# Altium project HDMI-MIPI-Bridge.PrjPcb
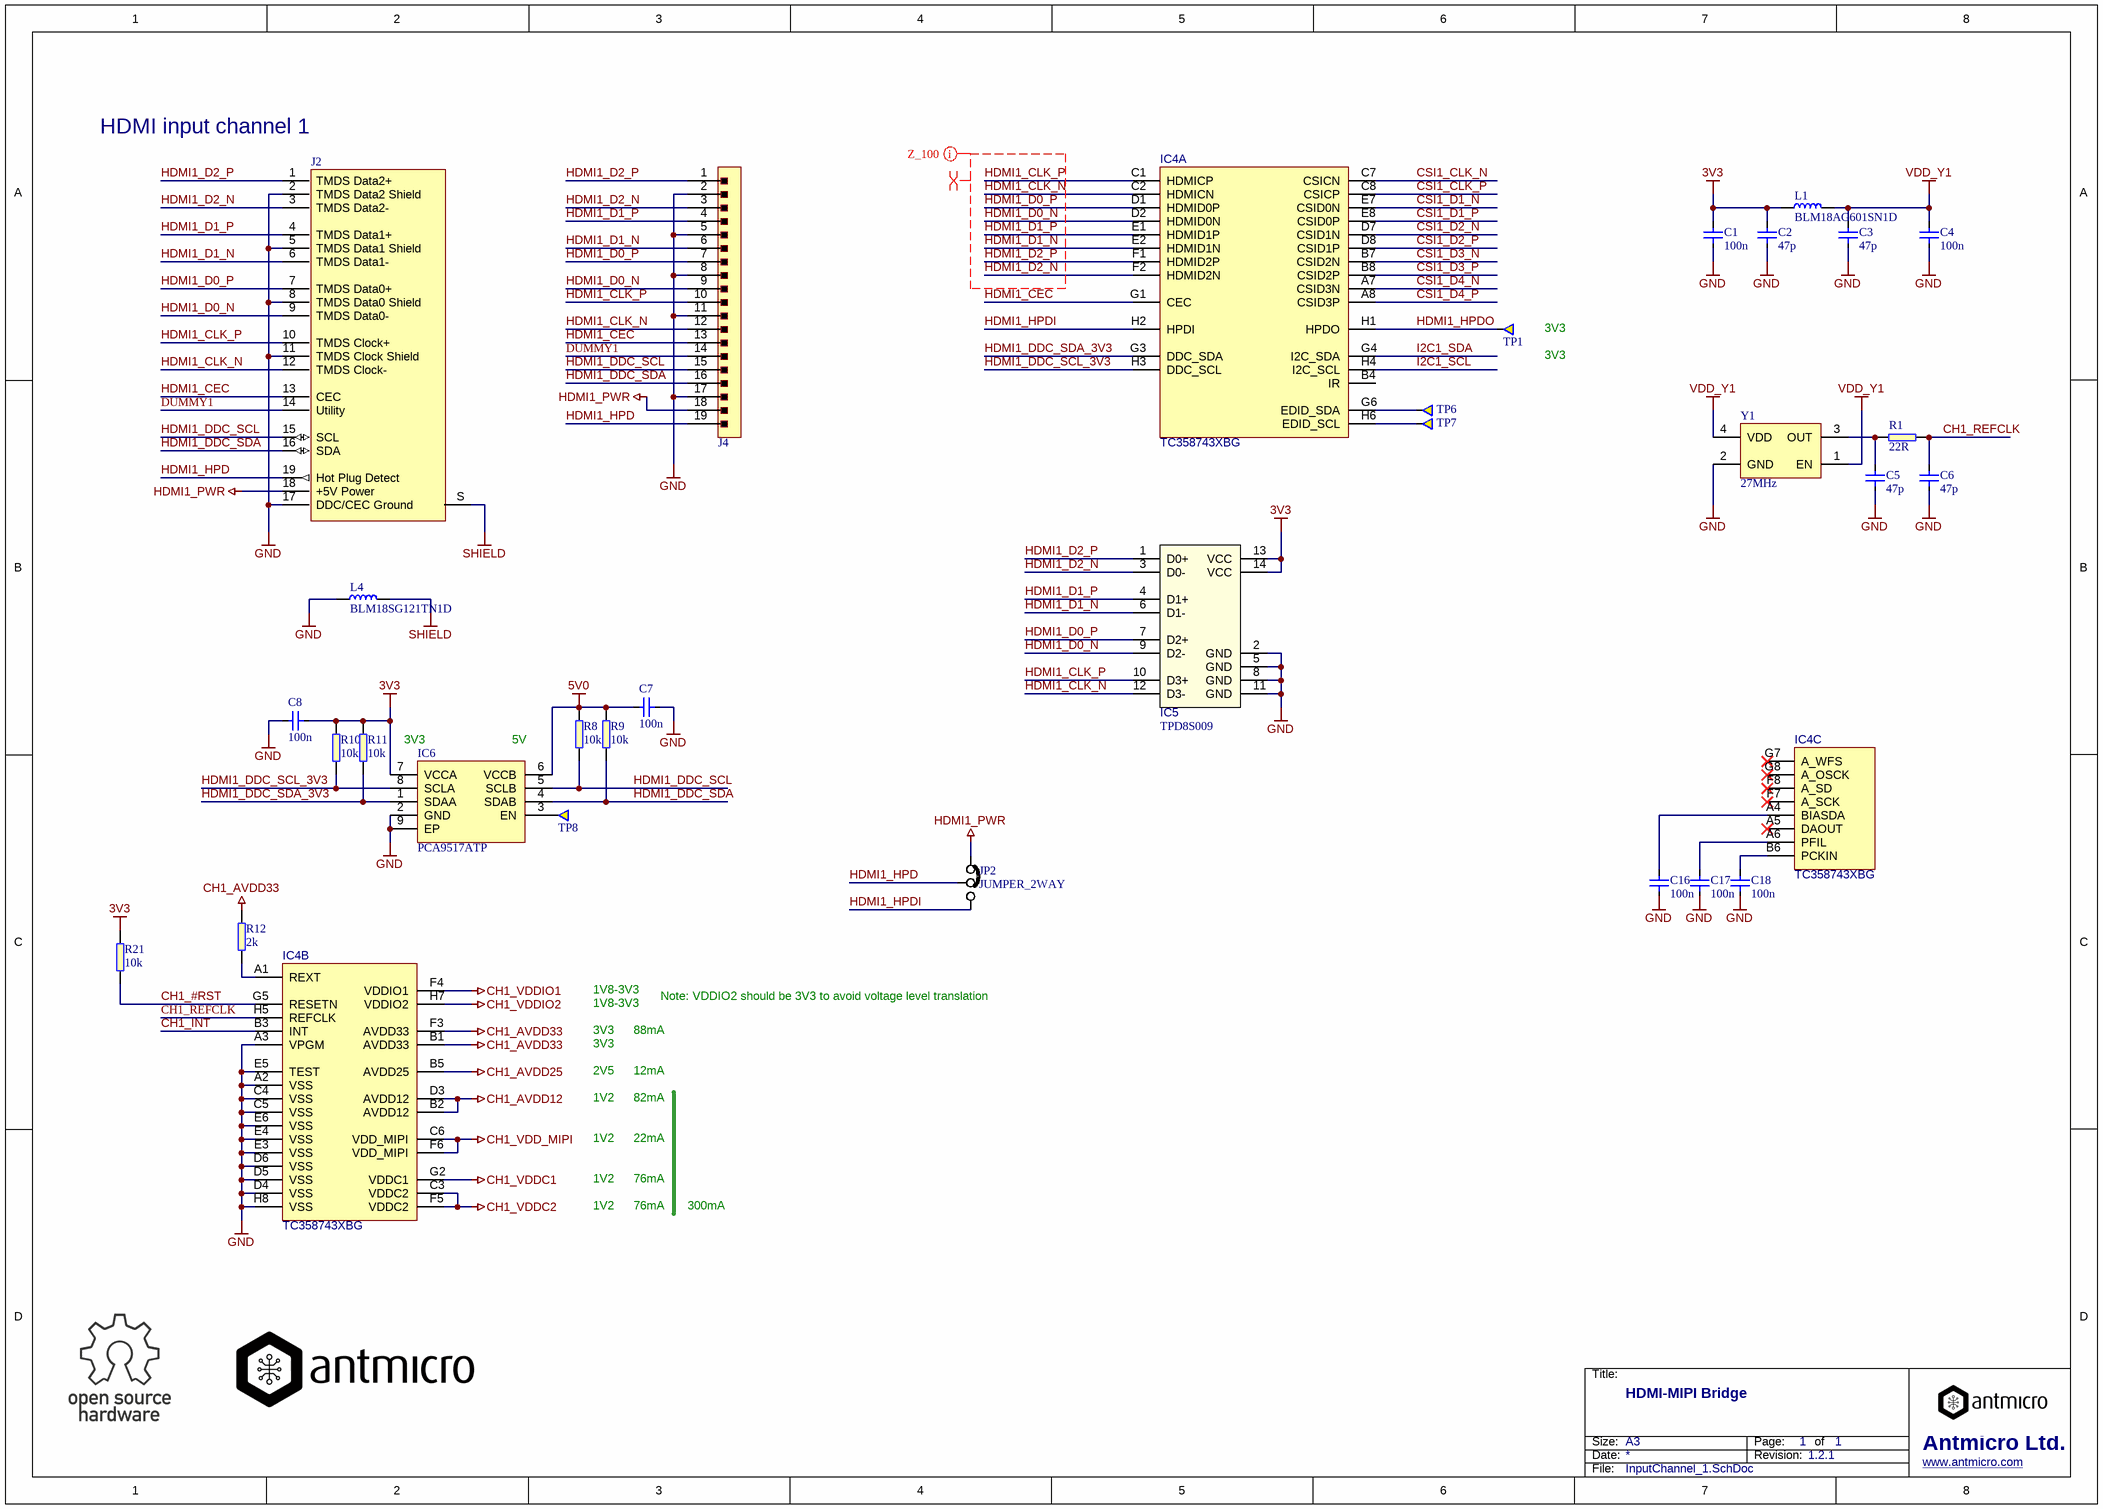
[diagram p0: InputChannel_1.SchDoc]
AM_Title: HDMI-MIPI Bridge; AM_Status: OSHW; AM_Revision: 1.2.1; AM_Author: P.Katarzynski
3 sheets, 113 parts. Net scope: global (net labels, ports and power ports of the same name join across sheets).
Board file: PCB.PcbDoc
Sheets:
  InputChannel_1.SchDoc
  InputChannel_2.SchDoc
  InterfaceConnector.SchDoc

## Sheet InputChannel_1.SchDoc
size A3; SheetNumber: 1; SheetTotal: 1; PageSetup: Record=PageOptions|CenterHorizontal=True|CenterVertical=True|PrintScale=0.97|XCorrection=1.00|YCorrection=1.00|PrintKind=1|BorderSize=5000000|LeftOffset=0|BottomOffset=0|Orientation=2|PaperLength=2970|PaperWidth=2100|Scale=100|PaperSource=7|PrintQuality=600|MediaType=1|DitherType=10|PaperKind=A4|PrintScaleMode=1

### Parts
C1  100n  [0402]
C2  47p  [0402]
C3  47p  [0402]
C4  100n  [0402]
C5  47p  [0402]
C6  47p  [0402]
C7  100n  [0402]
C8  100n  [0402]
C16  100n  [0402]
C17  100n  [0402]
C18  100n  [0402]
IC4  TC358743XBG  [TC358743XBG]  (parts A,B,C of 3)
IC5  TPD8S009  [SON-15]
IC6  PCA9517ATP  [PCA9517ATP]
J2  (no value)  [Molex_HDMI_471511001]
J4  Molex-505110-1992  [CON-Molex-505110-1992]  (value not drawn)
JP2  JUMPER_2WAY  [JUMPER_2WAY]  (no BOM)
L1  BLM18AG601SN1D  [0603]
L4  BLM18SG121TN1D  [0603]
R1  22R  [0402]
R8  10k  [0402]
R9  10k  [0402]
R10  10k  [0402]
R11  10k  [0402]
R12  2k  [0603]
R21  10k  [0402]
TP1  Testpad  [TP-R-1]  (value not drawn)  (no BOM)
TP6  Testpad  [TP-R-1]  (value not drawn)  (no BOM)
TP7  Testpad  [TP-R-1]  (value not drawn)  (no BOM)
TP8  Testpad  [TP-R-1]  (value not drawn)  (no BOM)
Y1  27MHz  [TXC_7C]

### Nets
3V3: C1.2 C2.2 C8.1 IC5.13(VCC) IC5.14(VCC) IC6.7(VCCA) L1.1 R10.2 R11.2 R21.2
5V0: C7.2 IC6.6(VCCB) R8.2 R9.2
CH1_AVDD12: IC4.B2(AVDD12) IC4.D3(AVDD12)
CH1_AVDD25: IC4.B5(AVDD25)
CH1_AVDD33: IC4.B1(AVDD33) IC4.F3(AVDD33) R12.2
CH1_VDD_MIPI: IC4.C6(VDD_MIPI) IC4.F6(VDD_MIPI)
CH1_VDDC1: IC4.G2(VDDC1)
CH1_VDDC2: IC4.C3(VDDC2) IC4.F5(VDDC2)
CH1_VDDIO1: IC4.F4(VDDIO1)
CH1_VDDIO2: IC4.H7(VDDIO2)
GND: C1.1 C2.1 C3.1 C4.1 C5.1 C6.1 C7.1 C8.2 C16.1 C17.1 C18.1 IC4.A2(VSS) IC4.A3(VPGM) IC4.C4(VSS) IC4.C5(VSS) IC4.D4(VSS) IC4.D5(VSS) IC4.D6(VSS) IC4.E3(VSS) IC4.E4(VSS) IC4.E5(TEST) IC4.E6(VSS) IC4.H8(VSS) IC5.2(GND) IC5.5(GND) IC5.8(GND) IC5.11(GND) IC6.2(GND) IC6.9(EP) J2.2(TMDS_Data2_Shield) J2.5(TMDS_Data1_Shield) J2.8(TMDS_Data0_Shield) J2.11(TMDS_Clock_Shield) J2.17(DDC/CEC_Ground) J4.2 J4.5 J4.8 J4.11 J4.17 L4.1 Y1.2(GND)
HDMI1_PWR: J2.18(+5V_Power) J4.18 JP2.1
SHIELD: J2.S(SH) L4.2
VDD_Y1: C3.2 C4.2 L1.2 Y1.1(EN) Y1.4(VDD)
CH1_#RST: IC4.G5(RESETN) R21.1
CH1_INT: IC4.B3(INT)
CH1_REFCLK: C6.2 IC4.H5(REFCLK) R1.2
CSI1_CLK_N: IC4.C7(CSICN)
CSI1_CLK_P: IC4.C8(CSICP)
CSI1_D1_N: IC4.E7(CSID0N)
CSI1_D1_P: IC4.E8(CSID0P)
CSI1_D2_N: IC4.D7(CSID1N)
CSI1_D2_P: IC4.D8(CSID1P)
CSI1_D3_N: IC4.B7(CSID2N)
CSI1_D3_P: IC4.B8(CSID2P)
CSI1_D4_N: IC4.A7(CSID3N)
CSI1_D4_P: IC4.A8(CSID3P)
DUMMY1: J2.14(Utility) J4.14
HDMI1_CEC: IC4.G1(CEC) J2.13(CEC) J4.13
HDMI1_CLK_N: IC4.C2(HDMICN) IC5.12(D3-) J2.12(TMDS_Clock-) J4.12
HDMI1_CLK_P: IC4.C1(HDMICP) IC5.10(D3+) J2.10(TMDS_Clock+) J4.10
HDMI1_D0_N: IC4.D2(HDMID0N) IC5.9(D2-) J2.9(TMDS_Data0-) J4.9
HDMI1_D0_P: IC4.D1(HDMID0P) IC5.7(D2+) J2.7(TMDS_Data0+) J4.7
HDMI1_D1_N: IC4.E2(HDMID1N) IC5.6(D1-) J2.6(TMDS_Data1-) J4.6
HDMI1_D1_P: IC4.E1(HDMID1P) IC5.4(D1+) J2.4(TMDS_Data1+) J4.4
HDMI1_D2_N: IC4.F2(HDMID2N) IC5.3(D0-) J2.3(TMDS_Data2-) J4.3
HDMI1_D2_P: IC4.F1(HDMID2P) IC5.1(D0+) J2.1(TMDS_Data2+) J4.1
HDMI1_DDC_SCL: IC6.5(SCLB) J2.15(SCL) J4.15 R8.1
HDMI1_DDC_SCL_3V3: IC4.H3(DDC_SCL) IC6.8(SCLA) R10.1
HDMI1_DDC_SDA: IC6.4(SDAB) J2.16(SDA) J4.16 R9.1
HDMI1_DDC_SDA_3V3: IC4.G3(DDC_SDA) IC6.1(SDAA) R11.1
HDMI1_HPD: J2.19(Hot_Plug_Detect) J4.19 JP2.2
HDMI1_HPDI: IC4.H2(HPDI) JP2.3
HDMI1_HPDO: IC4.H1(HPDO) TP1.1
I2C1_SCL: IC4.H4(I2C_SCL)
I2C1_SDA: IC4.G4(I2C_SDA)
NetC5_2: C5.2 R1.1 Y1.3(OUT)
NetC16_2: C16.2 IC4.A4(BIASDA)
NetC17_2: C17.2 IC4.A6(PFIL)
NetC18_2: C18.2 IC4.B6(PCKIN)
NetIC4_A1: IC4.A1(REXT) R12.1
NetIC4_G6: IC4.G6(EDID_SDA) TP6.1
NetIC4_H6: IC4.H6(EDID_SCL) TP7.1
NetIC6_3: IC6.3(EN) TP8.1

Not connected (* = marked no-connect by the designer): IC4 A5(DAOUT)* B4(IR) F7(A_SCK)* F8(A_SD)* G7(A_WFS)* G8(A_OSCK)*

### Layout directives
net class Z_100: HDMI1_CLK_N, HDMI1_CLK_P, HDMI1_D0_N, HDMI1_D0_P, HDMI1_D1_N, HDMI1_D1_P, HDMI1_D2_N, HDMI1_D2_P
differential pair: HDMI1_CLK_N, HDMI1_CLK_P, HDMI1_D0_N, HDMI1_D0_P, HDMI1_D1_N, HDMI1_D1_P, HDMI1_D2_N, HDMI1_D2_P

### Notes on the sheet
- (near J2) HDMI input channel 1
- (near TP1) 3V3
- 3V3
- (near IC6) 5V
- 1V8-3V3
- 88mA
- Note: VDDIO2 should be 3V3 to avoid voltage level translation
- 2V5
- 1V2
- 82mA
- 12mA
- 76mA
- 22mA
- 300mA
- Title:
- Size:
- Date:
- A3
- Revision:
- Page:
- of
- Antmicro Ltd.
- File:
- www.antmicro.com

### Library data of the parts
C1 C4 C7 C8 C16-C18 = C_100n_0402: MLCC SMT Capacitor 100nF 0402; Manufacturer: MULTICOMP; MPN: MC0402X104M100CT; Part Number: C_100n_0402; Value: 100n; Supplier 1: Farnell; Supplier Part Number 1: 2309011
C2 C3 C5 C6 = C_47p_0402: MLCC SMT Capacitor 47pF 0402; Manufacturer: KEMET; MPN: C0402C470J5GACTU; Part Number: C_47p_0402; Value: 47p; Supplier 1: Farnell; Supplier Part Number 1: 1414592
IC4 = TC358743XBG: Toshiba TC358743XBG HDMI-CSI bridge; Part Number: TC358743XBG; Value: TC358743XBG; Manufacturer: Toshiba; MPN: TC358743XBG
IC5 = TPD8S009: 8-Channel ESD Protection for DisplayPort and HDMI; Manufacturer: TEXAS INSTRUMENTS; MPN: TPD8S009DSMR; Part Number: TPD8S009; Value: TPD8S009; Supplier 1: Farnell; Supplier Part Number 1: 1772003
IC6 = PCA9517ATP: I2C BUS REPEATER W/ LEVEL TRANS, HWSON-8; Manufacturer: NXP; Part Number: PCA9517ATP; Value: PCA9517ATP; Supplier 1: Digi-Key; Supplier Part Number 1: 568-9816-1-ND; MPN: PCA9517ATP
J2 = CON-Molex-471511001: Header right angle HDMI; Manufacturer: MOLEX; MPN: 47151-1001; Part Number: CON-Molex-471511001; Supplier 1: Farnell; Supplier Part Number 1: 1516661
J4 = CON-Molex-505110-1992: FPC socket 19 pins; Manufacturer: Molex; Part Number: CON-Molex-505110-1992; Supplier Part Number 1: WM12375CT-ND; Value: Molex-505110-1992; Supplier 1: Digi-Key; MPN: 505110-1992
JP2 = Jumper 2 way: Solder jumper; Part Number: Jumper 2 way
L1 = BLM18AG601SN1D: Ferrite Bead, 600 ohm, 0603 [1608 Metric], BLM18A Series, 500 mA, 0.38 ohm, ± 25%; Manufacturer: MURATA; Part Number: BLM18AG601SN1D; Value: BLM18AG601SN1D; Supplier 1: Farnell; Supplier Part Number 1: 1515679; MPN: BLM18AG601SN1D
L4 = BLM18SG121TN1D: FERRITE BEAD, 0.025OHM, 3A, 0603; Manufacturer: MURATA; Part Number: BLM18SG121TN1D; Value: BLM18SG121TN1D; Supplier 1: Farnell; Supplier Part Number 1: 1515752; MPN: BLM18SG121TN1D
R1 = R_22R_0402: SMT Resistor 22R 0402; Manufacturer: VISHAY; MPN: CRCW040222R0FKED; Part Number: R_22R_0402; Value: 22R; Supplier 1: Farnell; Supplier Part Number 1: 1469697
R8-R11 R21 = R_10k_0402: SMT Resistor 0402; Manufacturer: MULTICOMP; MPN: MCMR04X1002FTL; Part Number: R_10k_0402; Value: 10k; Supplier 1: Farnell; Supplier Part Number 1: 2072517
R12 = R_2k_0603: SMT Resistor 2k 0603; Manufacturer: MULTICOMP; MPN: MCMR06X2001FTL; Part Number: R_2k_0603; Value: 2k; Supplier 1: Farnell; Supplier Part Number 1: 2073418
TP1 TP6-TP8 = TP-R-1: Testpad, round, 1mm; Part Number: TP-R-1
Y1 = 7C-27.000MBB-T: OSC, 27.000MHZ, 3.3V, SMD, 5.0X3.2; Manufacturer: TXC; Part Number: 7C-27.000MBB-T; Value: 27MHz; Supplier 1: Farnell; Supplier Part Number 1: 1842035; MPN: 7C-27.000MBB-T

## Sheet InputChannel_2.SchDoc
size A3; SheetNumber: 1; SheetTotal: 1; PageSetup: Record=PageOptions|CenterHorizontal=True|CenterVertical=True|PrintScale=0.97|XCorrection=1.00|YCorrection=1.00|PrintKind=1|BorderSize=5000000|LeftOffset=0|BottomOffset=0|Orientation=2|PaperLength=2970|PaperWidth=2100|Scale=100|PaperSource=7|PrintQuality=600|MediaType=1|DitherType=10|PaperKind=A4|PrintScaleMode=1
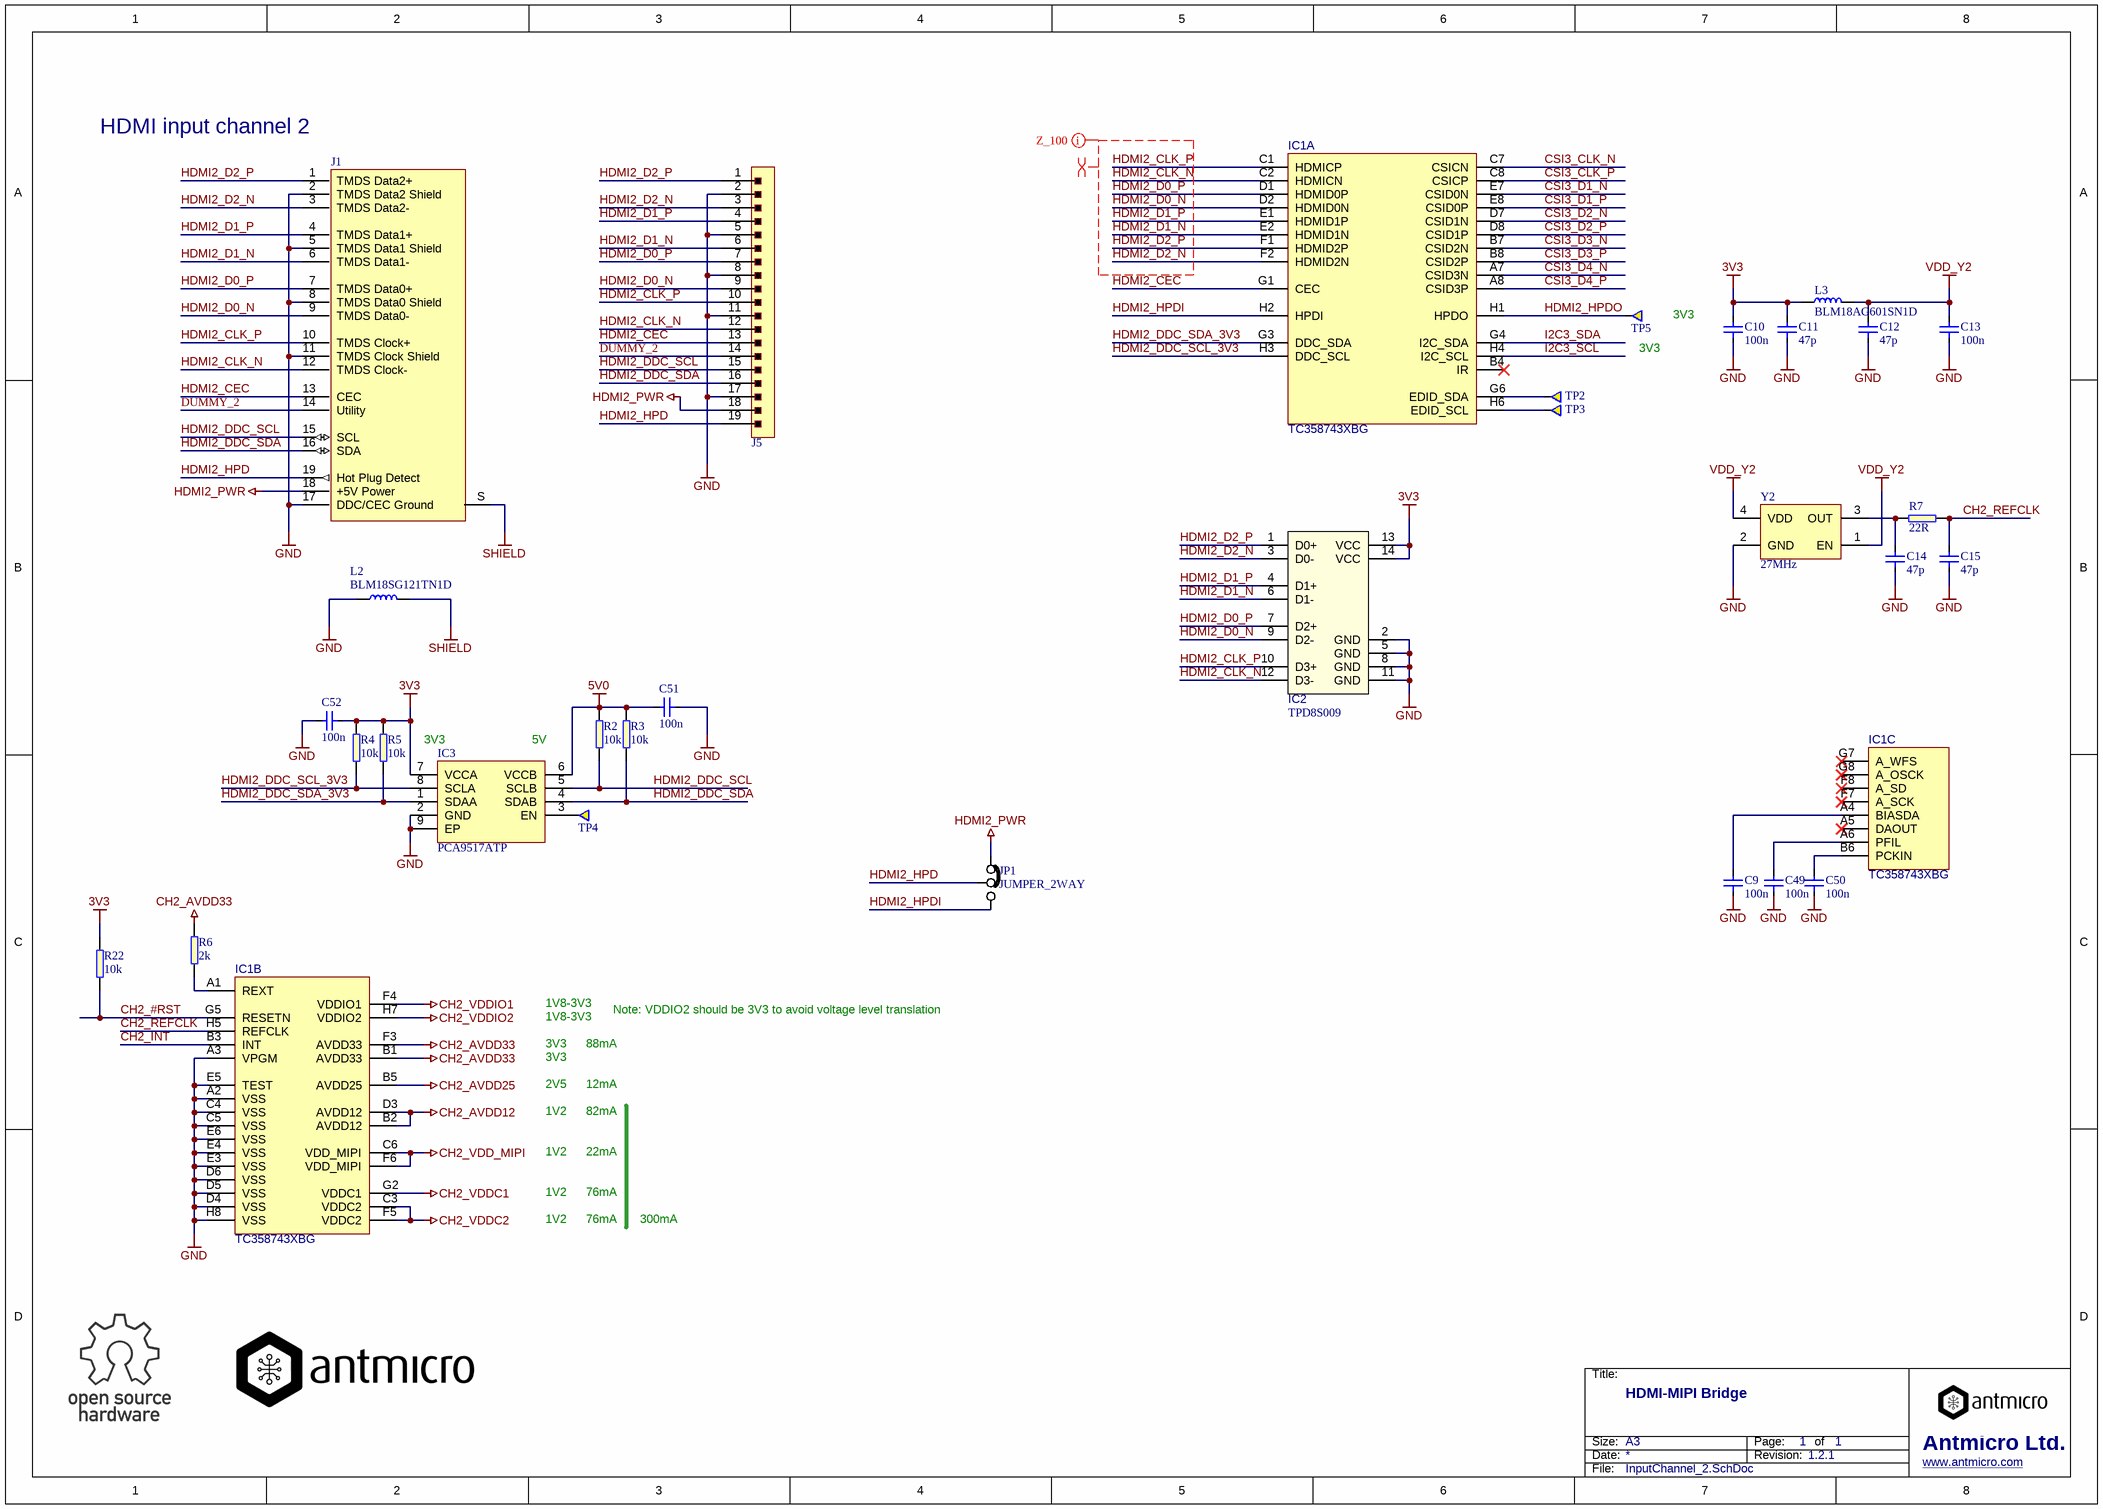
[diagram p1: InputChannel_2.SchDoc]

### Parts
C9  100n  [0402]
C10  100n  [0402]
C11  47p  [0402]
C12  47p  [0402]
C13  100n  [0402]
C14  47p  [0402]
C15  47p  [0402]
C49  100n  [0402]
C50  100n  [0402]
C51  100n  [0402]
C52  100n  [0402]
IC1  TC358743XBG  [TC358743XBG]  (parts A,B,C of 3)
IC2  TPD8S009  [SON-15]
IC3  PCA9517ATP  [PCA9517ATP]
J1  (no value)  [Molex_HDMI_471511001]
J5  Molex-505110-1992  [CON-Molex-505110-1992]  (value not drawn)
JP1  JUMPER_2WAY  [JUMPER_2WAY]  (no BOM)
L2  BLM18SG121TN1D  [0603]
L3  BLM18AG601SN1D  [0603]
R2  10k  [0402]
R3  10k  [0402]
R4  10k  [0402]
R5  10k  [0402]
R6  2k  [0603]
R7  22R  [0402]
R22  10k  [0402]
TP2  Testpad  [TP-R-1]  (value not drawn)  (no BOM)
TP3  Testpad  [TP-R-1]  (value not drawn)  (no BOM)
TP4  Testpad  [TP-R-1]  (value not drawn)  (no BOM)
TP5  Testpad  [TP-R-1]  (value not drawn)  (no BOM)
Y2  27MHz  [TXC_7C]

### Nets
3V3: C10.2 C11.2 C52.1 IC2.13(VCC) IC2.14(VCC) IC3.7(VCCA) L3.1 R4.2 R5.2 R22.2
5V0: C51.2 IC3.6(VCCB) R2.2 R3.2
CH2_AVDD12: IC1.B2(AVDD12) IC1.D3(AVDD12)
CH2_AVDD25: IC1.B5(AVDD25)
CH2_AVDD33: IC1.B1(AVDD33) IC1.F3(AVDD33) R6.2
CH2_VDD_MIPI: IC1.C6(VDD_MIPI) IC1.F6(VDD_MIPI)
CH2_VDDC1: IC1.G2(VDDC1)
CH2_VDDC2: IC1.C3(VDDC2) IC1.F5(VDDC2)
CH2_VDDIO1: IC1.F4(VDDIO1)
CH2_VDDIO2: IC1.H7(VDDIO2)
GND: C9.1 C10.1 C11.1 C12.1 C13.1 C14.1 C15.1 C49.1 C50.1 C51.1 C52.2 IC1.A2(VSS) IC1.A3(VPGM) IC1.C4(VSS) IC1.C5(VSS) IC1.D4(VSS) IC1.D5(VSS) IC1.D6(VSS) IC1.E3(VSS) IC1.E4(VSS) IC1.E5(TEST) IC1.E6(VSS) IC1.H8(VSS) IC2.2(GND) IC2.5(GND) IC2.8(GND) IC2.11(GND) IC3.2(GND) IC3.9(EP) J1.2(TMDS_Data2_Shield) J1.5(TMDS_Data1_Shield) J1.8(TMDS_Data0_Shield) J1.11(TMDS_Clock_Shield) J1.17(DDC/CEC_Ground) J5.2 J5.5 J5.8 J5.11 J5.17 L2.1 Y2.2(GND)
HDMI2_PWR: J1.18(+5V_Power) J5.18 JP1.1
SHIELD: J1.S(SH) L2.2
VDD_Y2: C12.2 C13.2 L3.2 Y2.1(EN) Y2.4(VDD)
CH2_#RST: IC1.G5(RESETN) R22.1
CH2_INT: IC1.B3(INT)
CH2_REFCLK: C15.2 IC1.H5(REFCLK) R7.2
CSI3_CLK_N: IC1.C7(CSICN)
CSI3_CLK_P: IC1.C8(CSICP)
CSI3_D1_N: IC1.E7(CSID0N)
CSI3_D1_P: IC1.E8(CSID0P)
CSI3_D2_N: IC1.D7(CSID1N)
CSI3_D2_P: IC1.D8(CSID1P)
CSI3_D3_N: IC1.B7(CSID2N)
CSI3_D3_P: IC1.B8(CSID2P)
CSI3_D4_N: IC1.A7(CSID3N)
CSI3_D4_P: IC1.A8(CSID3P)
DUMMY_2: J1.14(Utility) J5.14
HDMI2_CEC: IC1.G1(CEC) J1.13(CEC) J5.13
HDMI2_CLK_N: IC1.C2(HDMICN) IC2.12(D3-) J1.12(TMDS_Clock-) J5.12
HDMI2_CLK_P: IC1.C1(HDMICP) IC2.10(D3+) J1.10(TMDS_Clock+) J5.10
HDMI2_D0_N: IC1.D2(HDMID0N) IC2.9(D2-) J1.9(TMDS_Data0-) J5.9
HDMI2_D0_P: IC1.D1(HDMID0P) IC2.7(D2+) J1.7(TMDS_Data0+) J5.7
HDMI2_D1_N: IC1.E2(HDMID1N) IC2.6(D1-) J1.6(TMDS_Data1-) J5.6
HDMI2_D1_P: IC1.E1(HDMID1P) IC2.4(D1+) J1.4(TMDS_Data1+) J5.4
HDMI2_D2_N: IC1.F2(HDMID2N) IC2.3(D0-) J1.3(TMDS_Data2-) J5.3
HDMI2_D2_P: IC1.F1(HDMID2P) IC2.1(D0+) J1.1(TMDS_Data2+) J5.1
HDMI2_DDC_SCL: IC3.5(SCLB) J1.15(SCL) J5.15 R2.1
HDMI2_DDC_SCL_3V3: IC1.H3(DDC_SCL) IC3.8(SCLA) R4.1
HDMI2_DDC_SDA: IC3.4(SDAB) J1.16(SDA) J5.16 R3.1
HDMI2_DDC_SDA_3V3: IC1.G3(DDC_SDA) IC3.1(SDAA) R5.1
HDMI2_HPD: J1.19(Hot_Plug_Detect) J5.19 JP1.2
HDMI2_HPDI: IC1.H2(HPDI) JP1.3
HDMI2_HPDO: IC1.H1(HPDO) TP5.1
I2C3_SCL: IC1.H4(I2C_SCL)
I2C3_SDA: IC1.G4(I2C_SDA)
NetC9_2: C9.2 IC1.A4(BIASDA)
NetC14_2: C14.2 R7.1 Y2.3(OUT)
NetC49_2: C49.2 IC1.A6(PFIL)
NetC50_2: C50.2 IC1.B6(PCKIN)
NetIC1_A1: IC1.A1(REXT) R6.1
NetIC1_G6: IC1.G6(EDID_SDA) TP2.1
NetIC1_H6: IC1.H6(EDID_SCL) TP3.1
NetIC3_3: IC3.3(EN) TP4.1

Not connected (* = marked no-connect by the designer): IC1 A5(DAOUT)* B4(IR)* F7(A_SCK)* F8(A_SD)* G7(A_WFS)* G8(A_OSCK)*

### Layout directives
net class Z_100: HDMI2_CLK_N, HDMI2_CLK_P, HDMI2_D0_N, HDMI2_D0_P, HDMI2_D1_N, HDMI2_D1_P, HDMI2_D2_N, HDMI2_D2_P
differential pair: HDMI2_CLK_N, HDMI2_CLK_P, HDMI2_D0_N, HDMI2_D0_P, HDMI2_D1_N, HDMI2_D1_P, HDMI2_D2_N, HDMI2_D2_P

### Notes on the sheet
- (near J1) HDMI input channel 2
- 3V3
- (near TP5) 3V3
- (near IC3) 5V
- 1V8-3V3
- 88mA
- Note: VDDIO2 should be 3V3 to avoid voltage level translation
- 2V5
- 1V2
- 82mA
- 12mA
- 22mA
- 76mA
- 300mA
- Title:
- Size:
- Date:
- A3
- Revision:
- Page:
- of
- Antmicro Ltd.
- File:
- www.antmicro.com

### Library data of the parts
C9 C10 C13 C49-C52 = C_100n_0402: as C1 on sheet InputChannel_1; Part Number: C_100n_0402; Value: 100n; Supplier 1: Farnell; Supplier Part Number 1: 2309011
C11 C12 C14 C15 = C_47p_0402: as C2 on sheet InputChannel_1; Part Number: C_47p_0402; Value: 47p; Supplier 1: Farnell; Supplier Part Number 1: 1414592
IC1 = TC358743XBG: Toshiba TC358743XBG HDMI-CSI bridge; Part Number: TC358743XBG; Value: TC358743XBG; Manufacturer: Toshiba; MPN: TC358743XBG
IC2 = TPD8S009: as IC5 on sheet InputChannel_1; Part Number: TPD8S009; Value: TPD8S009; Supplier 1: Farnell; Supplier Part Number 1: 1772003
IC3 = PCA9517ATP: as IC6 on sheet InputChannel_1; Part Number: PCA9517ATP; Value: PCA9517ATP; Supplier 1: Digi-Key; Supplier Part Number 1: 568-9816-1-ND; MPN: PCA9517ATP
J1 = CON-Molex-471511001: as J2 on sheet InputChannel_1; Part Number: CON-Molex-471511001; Supplier 1: Farnell; Supplier Part Number 1: 1516661
J5 = CON-Molex-505110-1992: FPC socket 19 pins; Manufacturer: Molex; Part Number: CON-Molex-505110-1992; Supplier Part Number 1: WM12375CT-ND; Value: Molex-505110-1992; Supplier 1: Digi-Key; MPN: 505110-1992
JP1 = Jumper 2 way: Solder jumper; Part Number: Jumper 2 way
L2 = BLM18SG121TN1D: as L4 on sheet InputChannel_1; Part Number: BLM18SG121TN1D; Value: BLM18SG121TN1D; Supplier 1: Farnell; Supplier Part Number 1: 1515752; MPN: BLM18SG121TN1D
L3 = BLM18AG601SN1D: as L1 on sheet InputChannel_1; Part Number: BLM18AG601SN1D; Value: BLM18AG601SN1D; Supplier 1: Farnell; Supplier Part Number 1: 1515679; MPN: BLM18AG601SN1D
R2-R5 R22 = R_10k_0402: as R8 on sheet InputChannel_1; Part Number: R_10k_0402; Value: 10k; Supplier 1: Farnell; Supplier Part Number 1: 2072517
R6 = R_2k_0603: as R12 on sheet InputChannel_1; Part Number: R_2k_0603; Value: 2k; Supplier 1: Farnell; Supplier Part Number 1: 2073418
R7 = R_22R_0402: as R1 on sheet InputChannel_1; Part Number: R_22R_0402; Value: 22R; Supplier 1: Farnell; Supplier Part Number 1: 1469697
TP2-TP5 = TP-R-1: Testpad, round, 1mm; Part Number: TP-R-1
Y2 = 7C-27.000MBB-T: as Y1 on sheet InputChannel_1; Part Number: 7C-27.000MBB-T; Value: 27MHz; Supplier 1: Farnell; Supplier Part Number 1: 1842035; MPN: 7C-27.000MBB-T

## Sheet InterfaceConnector.SchDoc
size A3; SheetNumber: 1; SheetTotal: 1; PageSetup: Record=PageOptions|CenterHorizontal=True|CenterVertical=True|PrintScale=0.97|XCorrection=1.00|YCorrection=1.00|PrintKind=1|BorderSize=5000000|LeftOffset=0|BottomOffset=0|Orientation=2|PaperLength=2970|PaperWidth=2100|Scale=100|PaperSource=7|PrintQuality=600|MediaType=1|DitherType=10|PaperKind=A4|PrintScaleMode=1
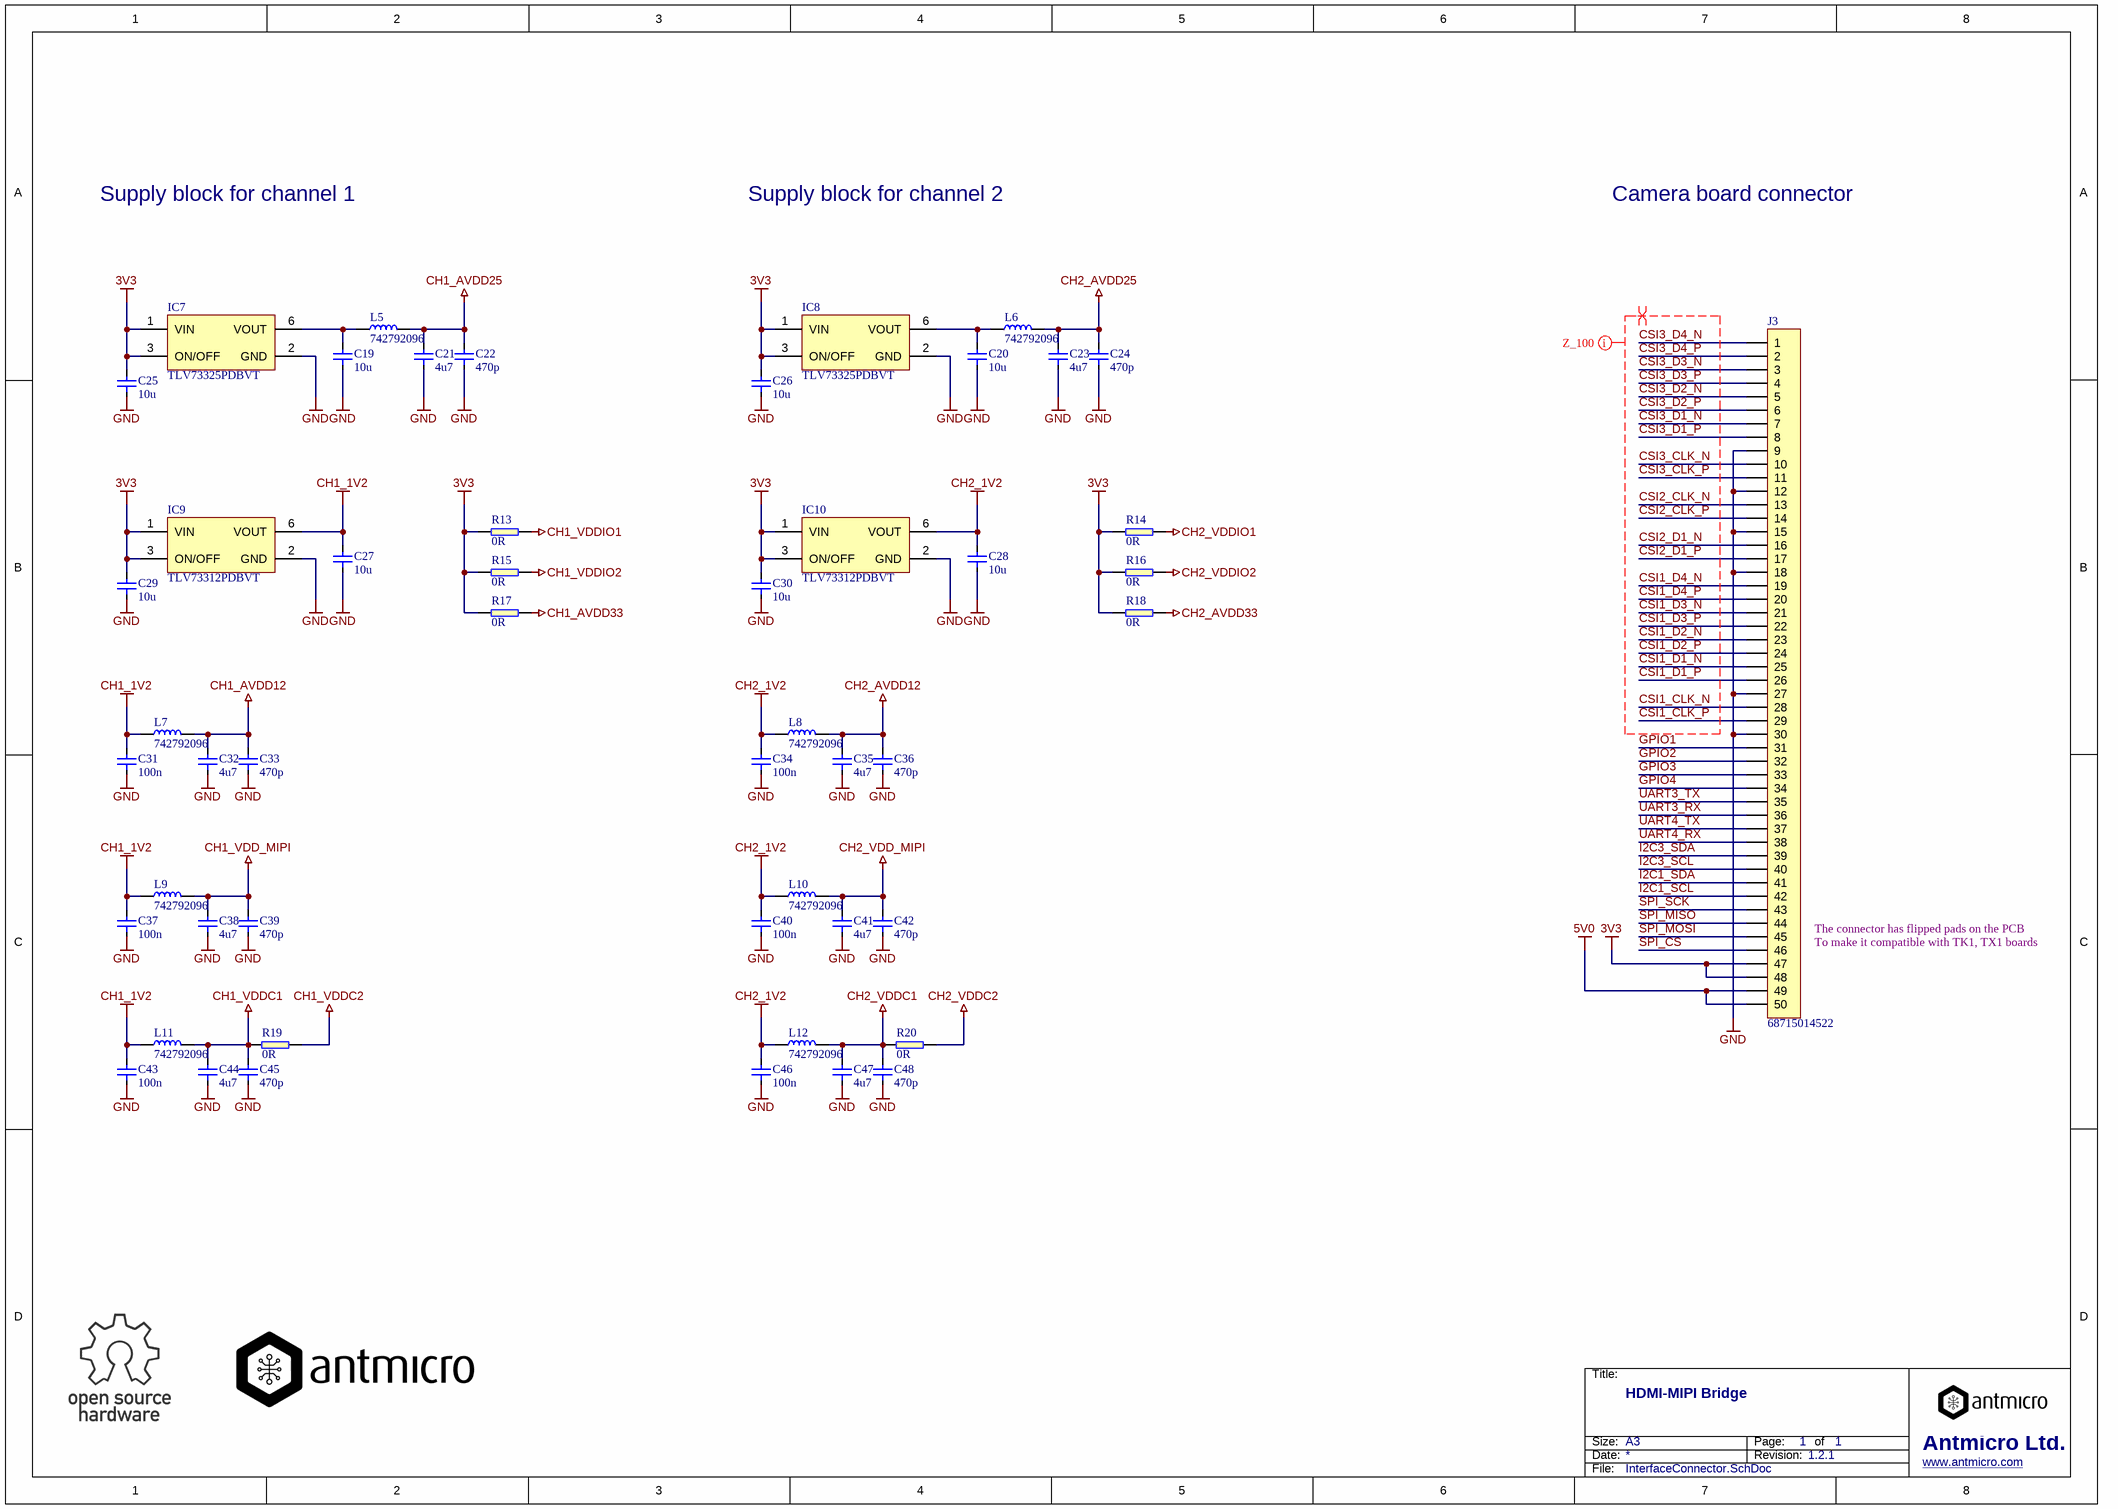
[diagram p2: InterfaceConnector.SchDoc]

### Parts
C19  10u  [0603]
C20  10u  [0603]
C21  4u7  [0402]
C22  470p  [0402]
C23  4u7  [0402]
C24  470p  [0402]
C25  10u  [0603]
C26  10u  [0603]
C27  10u  [0603]
C28  10u  [0603]
C29  10u  [0603]
C30  10u  [0603]
C31  100n  [0402]
C32  4u7  [0402]
C33  470p  [0402]
C34  100n  [0402]
C35  4u7  [0402]
C36  470p  [0402]
C37  100n  [0402]
C38  4u7  [0402]
C39  470p  [0402]
C40  100n  [0402]
C41  4u7  [0402]
C42  470p  [0402]
C43  100n  [0402]
C44  4u7  [0402]
C45  470p  [0402]
C46  100n  [0402]
C47  4u7  [0402]
C48  470p  [0402]
IC7  TLV73325PDBVT  [SOT23-5N]
IC8  TLV73325PDBVT  [SOT23-5N]
IC9  TLV73312PDBVT  [SOT23-5N]
IC10  TLV73312PDBVT  [SOT23-5N]
J3  68715014522  [68715014522_FLIPPED]
L5  742792096  [0805]
L6  742792096  [0805]
L7  742792096  [0805]
L8  742792096  [0805]
L9  742792096  [0805]
L10  742792096  [0805]
L11  742792096  [0805]
L12  742792096  [0805]
R13  0R  [0603]
R14  0R  [0603]
R15  0R  [0603]
R16  0R  [0603]
R17  0R  [0603]
R18  0R  [0603]
R19  0R  [0603]
R20  0R  [0603]

### Nets
3V3: C25.2 C26.2 C29.2 C30.2 IC7.1(VIN) IC7.3(ON/OFF) IC8.1(VIN) IC8.3(ON/OFF) IC9.1(VIN) IC9.3(ON/OFF) IC10.1(VIN) IC10.3(ON/OFF) J3.47 J3.48 R13.1 R14.1 R15.1 R16.1 R17.1 R18.1
5V0: J3.49 J3.50
CH1_1V2: C27.2 C31.2 C37.2 C43.2 IC9.6(VOUT) L7.1 L9.1 L11.1
CH1_AVDD12: C32.2 C33.2 L7.2
CH1_AVDD25: C21.2 C22.2 L5.2
CH1_AVDD33: R17.2
CH1_VDD_MIPI: C38.2 C39.2 L9.2
CH1_VDDC1: C44.2 C45.2 L11.2 R19.1
CH1_VDDC2: R19.2
CH1_VDDIO1: R13.2
CH1_VDDIO2: R15.2
CH2_1V2: C28.2 C34.2 C40.2 C46.2 IC10.6(VOUT) L8.1 L10.1 L12.1
CH2_AVDD12: C35.2 C36.2 L8.2
CH2_AVDD25: C23.2 C24.2 L6.2
CH2_AVDD33: R18.2
CH2_VDD_MIPI: C41.2 C42.2 L10.2
CH2_VDDC1: C47.2 C48.2 L12.2 R20.1
CH2_VDDC2: R20.2
CH2_VDDIO1: R14.2
CH2_VDDIO2: R16.2
GND: C19.1 C20.1 C21.1 C22.1 C23.1 C24.1 C25.1 C26.1 C27.1 C28.1 C29.1 C30.1 C31.1 C32.1 C33.1 C34.1 C35.1 C36.1 C37.1 C38.1 C39.1 C40.1 C41.1 C42.1 C43.1 C44.1 C45.1 C46.1 C47.1 C48.1 IC7.2(GND) IC8.2(GND) IC9.2(GND) IC10.2(GND) J3.9 J3.12 J3.15 J3.18 J3.27 J3.30
CSI1_CLK_N: J3.28
CSI1_CLK_P: J3.29
CSI1_D1_N: J3.25
CSI1_D1_P: J3.26
CSI1_D2_N: J3.23
CSI1_D2_P: J3.24
CSI1_D3_N: J3.21
CSI1_D3_P: J3.22
CSI1_D4_N: J3.19
CSI1_D4_P: J3.20
CSI2_CLK_N: J3.13
CSI2_CLK_P: J3.14
CSI2_D1_N: J3.16
CSI2_D1_P: J3.17
CSI3_CLK_N: J3.10
CSI3_CLK_P: J3.11
CSI3_D1_N: J3.7
CSI3_D1_P: J3.8
CSI3_D2_N: J3.5
CSI3_D2_P: J3.6
CSI3_D3_N: J3.3
CSI3_D3_P: J3.4
CSI3_D4_N: J3.1
CSI3_D4_P: J3.2
GPIO1: J3.31
GPIO2: J3.32
GPIO3: J3.33
GPIO4: J3.34
I2C1_SCL: J3.42
I2C1_SDA: J3.41
I2C3_SCL: J3.40
I2C3_SDA: J3.39
SPI_CS: J3.46
SPI_MISO: J3.44
SPI_MOSI: J3.45
SPI_SCK: J3.43
UART3_RX: J3.36
UART3_TX: J3.35
UART4_RX: J3.38
UART4_TX: J3.37
NetC19_2: C19.2 IC7.6(VOUT) L5.1
NetC20_2: C20.2 IC8.6(VOUT) L6.1

### Layout directives
differential pair: CSI1_CLK_N, CSI1_CLK_P, CSI1_D1_N, CSI1_D1_P, CSI1_D2_N, CSI1_D2_P, CSI1_D3_N, CSI1_D3_P, CSI1_D4_N, CSI1_D4_P, CSI2_CLK_N, CSI2_CLK_P, CSI2_D1_N, CSI2_D1_P, CSI3_CLK_N, CSI3_CLK_P, CSI3_D1_N, CSI3_D1_P, CSI3_D2_N, CSI3_D2_P, CSI3_D3_N, CSI3_D3_P, CSI3_D4_N, CSI3_D4_P
net class Z_100: CSI1_CLK_N, CSI1_CLK_P, CSI1_D1_N, CSI1_D1_P, CSI1_D2_N, CSI1_D2_P, CSI1_D3_N, CSI1_D3_P, CSI1_D4_N, CSI1_D4_P, CSI2_CLK_N, CSI2_CLK_P, CSI2_D1_N, CSI2_D1_P, CSI3_CLK_N, CSI3_CLK_P, CSI3_D1_N, CSI3_D1_P, CSI3_D2_N, CSI3_D2_P, CSI3_D3_N, CSI3_D3_P, CSI3_D4_N, CSI3_D4_P

### Notes on the sheet
- Supply block for channel 1
- Supply block for channel 2
- Camera board connector
- (near J3) The connector has flipped pads on the PCB
- (near J3) To make it compatible with TK1, TX1 boards
- Title:
- Size:
- Date:
- A3
- Revision:
- Page:
- of
- Antmicro Ltd.
- File:
- www.antmicro.com

### Library data of the parts
C19 C20 C25-C30 = C_10u_0603: MLCC SMT Capacitor 10uF 0603; Manufacturer: MULTICOMP; MPN: MC0603X106M6R3CT; Part Number: C_10u_0603; Value: 10u; Supplier 1: Farnell; Supplier Part Number 1: 1759393
C21 C23 C32 C35 C38 C41 C44 C47 = C_4u7_0402: MLCC SMT Capacitor 4u7F 0603; Manufacturer: MURATA; MPN: GRM155R60G475ME; Part Number: C_4u7_0402; Value: 4u7; Supplier 1: Farnell; Supplier Part Number 1: 1735525
C22 C24 C33 C36 C39 C42 C45 C48 = C_470p_0402: MLCC SMT Capacitor 470pF 0402; Manufacturer: MULTICOMP; MPN: MC0402B471J500CT; Part Number: C_470p_0402; Value: 470p; Supplier 1: Farnell; Supplier Part Number 1: 2320771
C31 C34 C37 C40 C43 C46 = C_100n_0402: as C1 on sheet InputChannel_1; Part Number: C_100n_0402; Value: 100n; Supplier 1: Farnell; Supplier Part Number 1: 2309011
IC7 IC8 = TLV73325PDBVT: Linear Voltage Regulator IC Positive Fixed Output 2.5V 300mA SOT-23-5; Manufacturer: TEXAS INSTRUMENTS; Part Number: TLV73325PDBVT; Value: TLV73325PDBVT; Supplier 1: Farnell; Supplier Part Number 1: 2455143; MPN: TLV73325PDBVT
IC9 IC10 = TLV73312PDBVT: Linear Voltage Regulator IC Positive Fixed Output 3.3V 300mA SOT-23-5; Manufacturer: TEXAS INSTRUMENTS; Part Number: TLV73312PDBVT; Value: TLV73312PDBVT; Supplier 1: Farnell; Supplier Part Number 1: 2455137; MPN: TLV73312PDBVT
J3 = WE-687-150-145-22_FLIPPED: 0.50mm SMT ZIF Horizontal Bottom Contact WR-FPC; Manufacturer: WURTH ELEKTRONIK; Part Number: WE-687-150-145-22_FLIPPED; Supplier Part Number 1: 1908481; Value: 68715014522; Supplier 1: Farnell; MPN: 68715014522
L5-L12 = Wurth-742792096: FERRITE BEAD, 1kOhm 1A; Manufacturer: WURTH ELEKTRONIK; Part Number: Wurth-742792096; Value: 742792096; Supplier 1: Farnell; Supplier Part Number 1: 1635737; MPN: 742792096
R13-R20 = R_0R_0603: SMT Resistor 0R 0603; Manufacturer: BOURNS; MPN: CR0603-J/-000ELF; Part Number: R_0R_0603; Value: 0R; Supplier 1: Farnell; Supplier Part Number 1: 2008343

## Nets that join several sheets
3V3: InputChannel_1 (10 pins), InputChannel_2 (10 pins), InterfaceConnector (20 pins)
5V0: InputChannel_1 (C7.2 IC6.6 R8.2 R9.2), InputChannel_2 (C51.2 IC3.6 R2.2 R3.2), InterfaceConnector (J3.49 J3.50)
CH1_AVDD12: InputChannel_1 (IC4.B2 IC4.D3), InterfaceConnector (C32.2 C33.2 L7.2)
CH1_AVDD25: InputChannel_1 (IC4.B5), InterfaceConnector (C21.2 C22.2 L5.2)
CH1_AVDD33: InputChannel_1 (IC4.B1 IC4.F3 R12.2), InterfaceConnector (R17.2)
CH1_VDD_MIPI: InputChannel_1 (IC4.C6 IC4.F6), InterfaceConnector (C38.2 C39.2 L9.2)
CH1_VDDC1: InputChannel_1 (IC4.G2), InterfaceConnector (C44.2 C45.2 L11.2 R19.1)
CH1_VDDC2: InputChannel_1 (IC4.C3 IC4.F5), InterfaceConnector (R19.2)
CH1_VDDIO1: InputChannel_1 (IC4.F4), InterfaceConnector (R13.2)
CH1_VDDIO2: InputChannel_1 (IC4.H7), InterfaceConnector (R15.2)
CH2_AVDD12: InputChannel_2 (IC1.B2 IC1.D3), InterfaceConnector (C35.2 C36.2 L8.2)
CH2_AVDD25: InputChannel_2 (IC1.B5), InterfaceConnector (C23.2 C24.2 L6.2)
CH2_AVDD33: InputChannel_2 (IC1.B1 IC1.F3 R6.2), InterfaceConnector (R18.2)
CH2_VDD_MIPI: InputChannel_2 (IC1.C6 IC1.F6), InterfaceConnector (C41.2 C42.2 L10.2)
CH2_VDDC1: InputChannel_2 (IC1.G2), InterfaceConnector (C47.2 C48.2 L12.2 R20.1)
CH2_VDDC2: InputChannel_2 (IC1.C3 IC1.F5), InterfaceConnector (R20.2)
CH2_VDDIO1: InputChannel_2 (IC1.F4), InterfaceConnector (R14.2)
CH2_VDDIO2: InputChannel_2 (IC1.H7), InterfaceConnector (R16.2)
GND: InputChannel_1 (41 pins), InputChannel_2 (41 pins), InterfaceConnector (40 pins)
SHIELD: InputChannel_1 (J2.S L4.2), InputChannel_2 (J1.S L2.2)
CSI1_CLK_N: InputChannel_1 (IC4.C7), InterfaceConnector (J3.28)
CSI1_CLK_P: InputChannel_1 (IC4.C8), InterfaceConnector (J3.29)
CSI1_D1_N: InputChannel_1 (IC4.E7), InterfaceConnector (J3.25)
CSI1_D1_P: InputChannel_1 (IC4.E8), InterfaceConnector (J3.26)
CSI1_D2_N: InputChannel_1 (IC4.D7), InterfaceConnector (J3.23)
CSI1_D2_P: InputChannel_1 (IC4.D8), InterfaceConnector (J3.24)
CSI1_D3_N: InputChannel_1 (IC4.B7), InterfaceConnector (J3.21)
CSI1_D3_P: InputChannel_1 (IC4.B8), InterfaceConnector (J3.22)
CSI1_D4_N: InputChannel_1 (IC4.A7), InterfaceConnector (J3.19)
CSI1_D4_P: InputChannel_1 (IC4.A8), InterfaceConnector (J3.20)
CSI3_CLK_N: InputChannel_2 (IC1.C7), InterfaceConnector (J3.10)
CSI3_CLK_P: InputChannel_2 (IC1.C8), InterfaceConnector (J3.11)
CSI3_D1_N: InputChannel_2 (IC1.E7), InterfaceConnector (J3.7)
CSI3_D1_P: InputChannel_2 (IC1.E8), InterfaceConnector (J3.8)
CSI3_D2_N: InputChannel_2 (IC1.D7), InterfaceConnector (J3.5)
CSI3_D2_P: InputChannel_2 (IC1.D8), InterfaceConnector (J3.6)
CSI3_D3_N: InputChannel_2 (IC1.B7), InterfaceConnector (J3.3)
CSI3_D3_P: InputChannel_2 (IC1.B8), InterfaceConnector (J3.4)
CSI3_D4_N: InputChannel_2 (IC1.A7), InterfaceConnector (J3.1)
CSI3_D4_P: InputChannel_2 (IC1.A8), InterfaceConnector (J3.2)
I2C1_SCL: InputChannel_1 (IC4.H4), InterfaceConnector (J3.42)
I2C1_SDA: InputChannel_1 (IC4.G4), InterfaceConnector (J3.41)
I2C3_SCL: InputChannel_2 (IC1.H4), InterfaceConnector (J3.40)
I2C3_SDA: InputChannel_2 (IC1.G4), InterfaceConnector (J3.39)

## Assembly variants
HDMI: not fitted J4 J5
FFC: not fitted J1 J2
Prototype: not fitted J4 J5